# Altium schematic sheet Gate_Drive.SchDoc
size A4
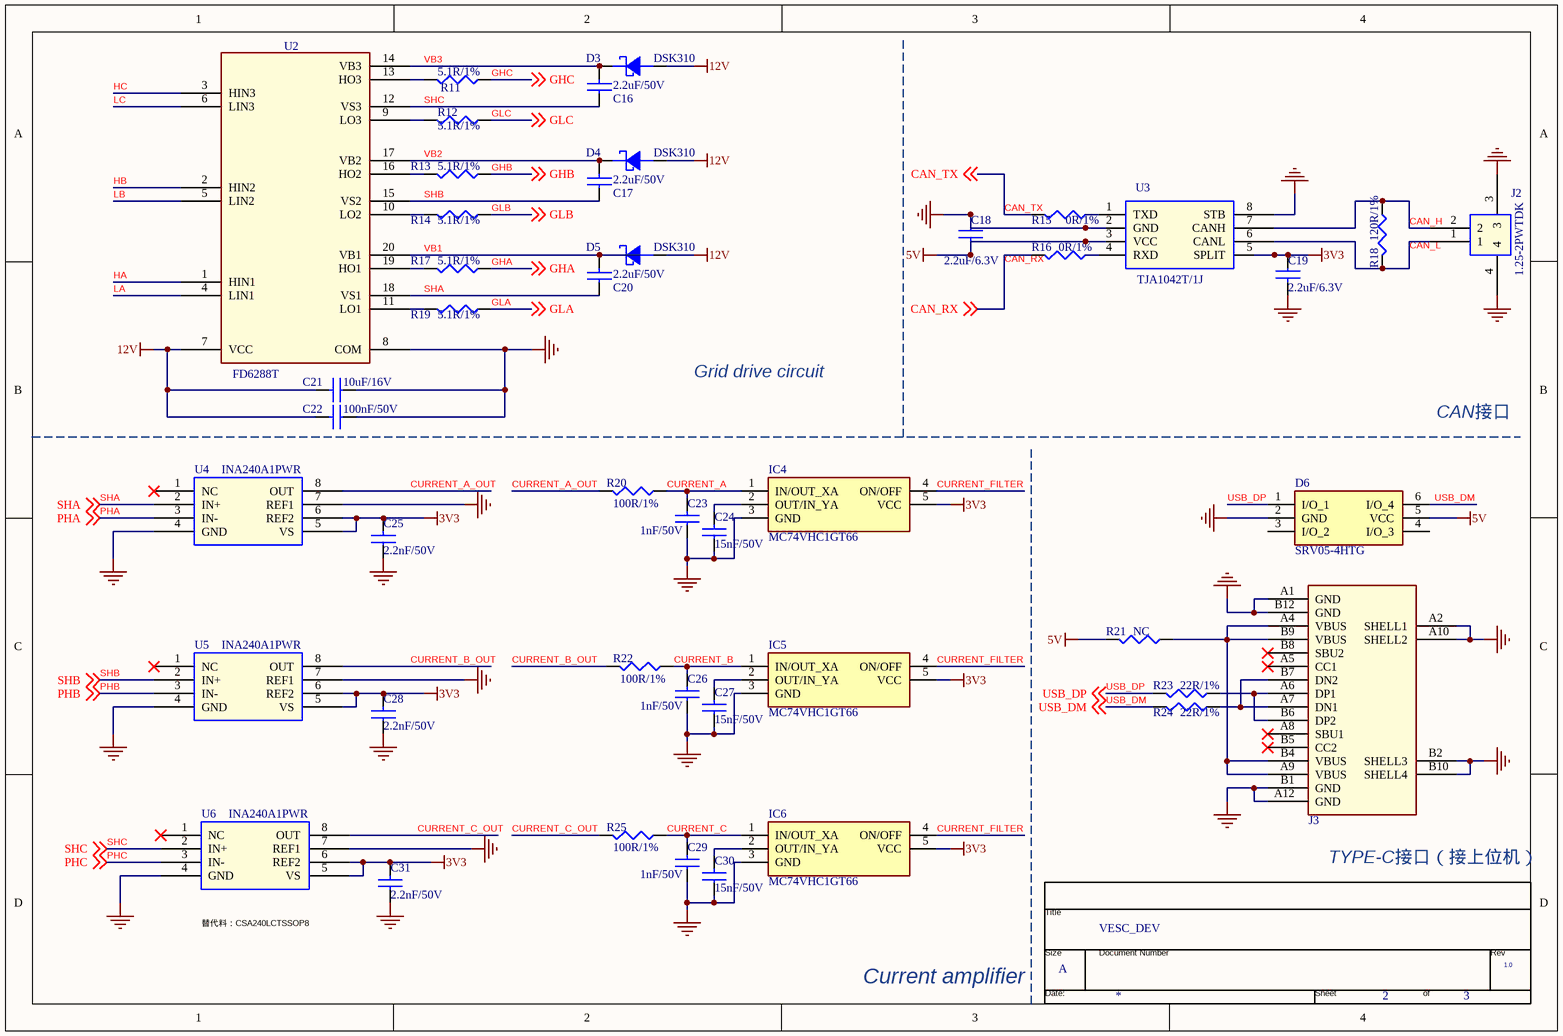
[diagram p0: Gate_Drive.SchDoc]

## Parts
*  Page Count: 3  Page Number: 2  Page Size: A  Title: VESC_DEV  RevCode: 1.0  (hidden comment: TitleBlock0)  (graphical)
C16  2.2uF/50V  [C0603]
C17  2.2uF/50V  [C0603]
C18  2.2uF/6.3V  [C0402]
C19  2.2uF/6.3V  [C0402]
C20  2.2uF/50V  [C0603]
C21  10uF/16V  [C0603]
C22  100nF/50V  [C0402]
C23  1nF/50V  [C0402]
C24  15nF/50V  [C0402]
C25  2.2nF/50V  [C0402]
C26  1nF/50V  [C0402]
C27  15nF/50V  [C0402]
C28  2.2nF/50V  [C0402]
C29  1nF/50V  [C0402]
C30  15nF/50V  [C0402]
C31  2.2nF/50V  [C0402]
D3  DSK310  [SOD-123F]
D4  DSK310  [SOD-123F]
D5  DSK310  [SOD-123F]
D6  SRV05-4HTG  [SOT95P280X145-6N]
IC4  MC74VHC1GT66  [SOT95P275X110-5N]
IC5  MC74VHC1GT66  [SOT95P275X110-5N]
IC6  MC74VHC1GT66  [SOT95P275X110-5N]
J2  1.25-2PWTDK  [SMD-2P-1_25]
J3  TYPE-C 16PLC-H10.0  [TYPE-C-TH_16PLC-H10.0]  (value not drawn)
R11  5.1R/1%  [R0603]
R12  5.1R/1%  [R0603]
R13  5.1R/1%  [R0603]
R14  5.1R/1%  [R0603]
R15  0R/1%  [R0402]
R16  0R/1%  [R0402]
R17  5.1R/1%  [R0603]
R18  120R/1%  [R0402]
R19  5.1R/1%  [R0603]
R20  100R/1%  [R0402]
R21  NC  [R0603]
R22  100R/1%  [R0402]
R23  22R/1%  [R0402]
R24  22R/1%  [R0402]
R25  100R/1%  [R0402]
U2  FD6288T  [TSSOP-20]
U3  TJA1042T/1J  [SOP-8]
U4  INA240A1PWR  [TSSOP-8]
U5  INA240A1PWR  [TSSOP-8]
U6  INA240A1PWR  [TSSOP-8]

## Nets
3V3: C19.1 C25.2 C28.2 C31.2 IC4.5(VCC) IC5.5(VCC) IC6.5(VCC) U3.5(SPLIT) U4.5(VS) U4.6(REF2) U5.5(VS) U5.6(REF2) U6.5(VS) U6.6(REF2)
5V: C18.2 D6.5(VCC) R21.2 U3.3(VCC)
12V: C21.2 C22.2 D3.2(A) D4.2(A) D5.2(A) U2.7(VCC)
GND: C18.1 C19.2 C21.1 C22.1 C23.1 C24.1 C25.1 C26.1 C27.1 C28.1 C29.1 C30.1 C31.1 D6.2(GND) IC4.3(GND) IC5.3(GND) IC6.3(GND) J2.3 J2.4 J3.A1(GND) J3.A2(SHELL1) J3.A10(SHELL2) J3.A12(GND) J3.B1(GND) J3.B2(SHELL3) J3.B10(SHELL4) J3.B12(GND) U2.8(COM) U3.2(GND) U3.8(STB) U4.4(GND) U4.7(REF1) U5.4(GND) U5.7(REF1) U6.4(GND) U6.7(REF1)
CAN_H: J2.2 R18.1 U3.7(CANH)
CAN_L: J2.1 R18.2 U3.6(CANL)
CAN_RX: R16.2 ; off-sheet CAN_RX
CAN_TX: R15.2 ; off-sheet CAN_TX
CURRENT_A: C23.2 IC4.1(IN/OUT_XA) R20.1
CURRENT_A_OUT: R20.2 U4.8(OUT)
CURRENT_B: C26.2 IC5.1(IN/OUT_XA) R22.1
CURRENT_B_OUT: R22.2 U5.8(OUT)
CURRENT_C: C29.2 IC6.1(IN/OUT_XA) R25.1
CURRENT_C_OUT: R25.2 U6.8(OUT)
CURRENT_FILTER: IC4.4(ON/OFF) IC5.4(ON/OFF) IC6.4(ON/OFF)
GHA: R17.1 ; off-sheet GHA
GHB: R13.1 ; off-sheet GHB
GHC: R11.1 ; off-sheet GHC
GLA: R19.1 ; off-sheet GLA
GLB: R14.1 ; off-sheet GLB
GLC: R12.1 ; off-sheet GLC
HA: U2.1(HIN1)
HB: U2.2(HIN2)
HC: U2.3(HIN3)
LA: U2.4(LIN1)
LB: U2.5(LIN2)
LC: U2.6(LIN3)
PHA: U4.3(IN-) ; off-sheet PHA
PHB: U5.3(IN-) ; off-sheet PHB
PHC: U6.3(IN-) ; off-sheet PHC
SHA: C20.1 U2.18(VS1) U4.2(IN+) ; off-sheet SHA
SHB: C17.1 U2.15(VS2) U5.2(IN+) ; off-sheet SHB
SHC: C16.1 U2.12(VS3) U6.2(IN+) ; off-sheet SHC
USB_DM: D6.6(I/O_4) R24.2 ; off-sheet USB_DM
USB_DP: D6.1(I/O_1) R23.2 ; off-sheet USB_DP
VB1: C20.2 D5.1(K) U2.20(VB1)
VB2: C17.2 D4.1(K) U2.17(VB2)
VB3: C16.2 D3.1(K) U2.14(VB3)
NetC24_2: C24.2 IC4.2(OUT/IN_YA)
NetC27_2: C27.2 IC5.2(OUT/IN_YA)
NetC30_2: C30.2 IC6.2(OUT/IN_YA)
NetJ3_A4: J3.A4(VBUS) J3.A9(VBUS) J3.B4(VBUS) J3.B9(VBUS) R21.1
NetJ3_A6: J3.A6(DP1) J3.B6(DP2) R23.1
NetJ3_A7: J3.A7(DN1) J3.B7(DN2) R24.1
NetR11_2: R11.2 U2.13(HO3)
NetR12_2: R12.2 U2.9(LO3)
NetR13_2: R13.2 U2.16(HO2)
NetR14_2: R14.2 U2.10(LO2)
NetR15_1: R15.1 U3.1(TXD)
NetR16_1: R16.1 U3.4(RXD)
NetR17_2: R17.2 U2.19(HO1)
NetR19_2: R19.2 U2.11(LO1)

Not connected (* = marked no-connect by the designer): D6 3(I/O_2) 4(I/O_3); J3 A5(CC1)* A8(SBU1)* B5(CC2)* B8(SBU2)*; U4 1(NC)*; U5 1(NC)*; U6 1(NC)*

## Notes on the sheet
- Grid drive circuit
- CAN接口
- (near U6) 替代料：CSA240LCTSSOP8
- (near J3) TYPE-C接口（接上位机）
- Current amplifier
- (in symbol TitleBlock0) Title; Size; Document Number; Rev; Date:; Sheet; of

## Library data of the parts
C16-C31 = CAP NP
  C16 C17 C20 C21: PCB Footprint: C0603
  C18 C19 C22-C31: PCB Footprint: C0402
D3-D5 = DIODE SCHOTTKY21: PCB Footprint: SOD-123F
D6 = SRV05-4HTG: TVS Diode (Uni-directional); Manufacturer_Name: LITTELFUSE; Datasheet Link: https://componentsearchengine.com/Datasheets/2/SRV05-4HTG.pdf; Height: 1.45mm; Manufacturer_Part_Number: SRV05-4HTG; Mouser Part Number: 576-SRV05-4HTG; Mouser Price/Stock: https://www.mouser.co.uk/ProductDetail/Littelfuse/SRV05-4HTG?qs=TI15CVqcli3Liexbf3C%2FVA%3D%3D; Arrow Part Number: SRV05-4HTG; Arrow Price/Stock: https://www.arrow.com/en/products/srv05-4htg/littelfuse?region=nac
IC4-IC6 = MC74VHC1GT66: Integrated Circuit; Manufacturer_Name: onsemi; Datasheet Link: https://pdf1.alldatasheet.com/datasheet-pdf/view/148919/ETL/MC74VHC1GT66.html; Height: 1.1mm; Manufacturer_Part_Number: MC74VHC1GT66; Mouser Part Number: N/A; Mouser Price/Stock: https://www.mouser.co.uk/ProductDetail/onsemi/MC74VHC1GT66?qs=YA77FY0Msbu77w80Y0DYXA%3D%3D
J3 = TYPE-C 16PLC-H10.0: 连接器类型:Type-C;标准:USB 3.1;公母:母;安装方式:直插;触点数量:16P;端口数量:1;额定电流 - 电源:5A;触头材质:-;触头镀层:-;工作温度范围:-40℃~+85℃;; Manufacturer: SHOU HAN(首韩); Add into BOM: yes; Gender: 母; Number of Contacts: 16P; Number of Ports: 1; Current Rating - Power (Max): 5A; Rated Voltage (Max): 20V; Connect-Disconnect Life: 1万次; Core Colour: 黑色; Symbol: TYPE-C 16PLC-H10.0; Device: TYPE-C 16PLC-H10.0; LCSC Part Name: Type-C 母 直插; Supplier Part: C3151747; Manufacturer Part: TYPE-C 16PLC-H10.0; Supplier Footprint: 插件; Datasheet: https://atta.szlcsc.com/upload/public/pdf/source/20240529/CC9428849977884A813B584EA396EFE9.pdf; Supplier: LCSC; Convert to PCB: yes; Connector Type: Type-C; Standard: USB 3.1; Mounting Style: 直插; Contact Material: -; Contact Plating: -; Operating Temperature Range: -40℃~+85℃
R11-R14 R17 R19 = RESISTOR: PCB Footprint: R0402
R15 R16 R18 R20-R25 = RESISTOR
  R15 R16 R18 R20 R22-R25: PCB Footprint: R0402
  R21: PCB Footprint: R0603
* = TitleBlock0: Page Create Date: March  8, 1995; Page Modify Date: *
J2 = 1.25-2PWTDK: PCB Footprint: SMD-2P-1_25
U3 = TJA1042T/1J: PCB Footprint: SOP-8
U4-U6 = INA240A1PWR: PCB Footprint: TSSOP-8